# Altium schematic sheet [2]-BLOCK_DIAGRAM.SchDoc
size A4
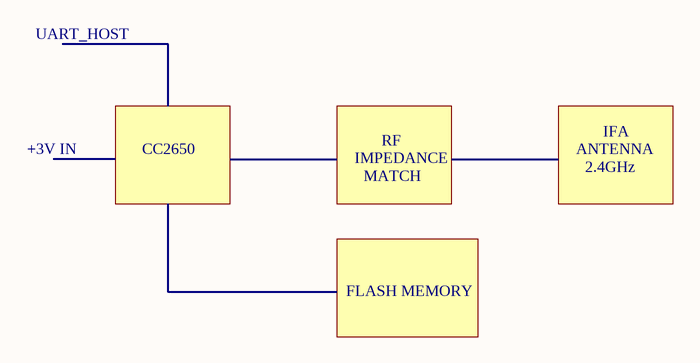
[diagram p0: [2]-BLOCK_DIAGRAM.SchDoc]

## Notes on the sheet
- UART_HOST
- +3V IN
- CC2650
- IMPEDANCE
- MATCH
- RF
- ANTENNA
- 2.4GHz
- IFA
- FLASH MEMORY